# Altium schematic sheet energy_harvesting.SchDoc: Triumvi - EH
size Letter; Author: Ye-Sheng Kuo; Revision: 11; SheetNumber: 4; SheetTotal: 10
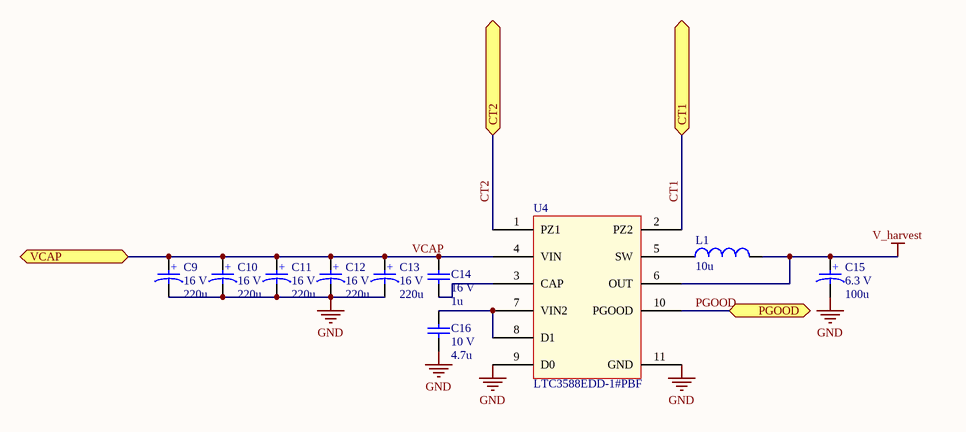
[diagram p0: energy_harvesting.SchDoc]

## Parts
C9  voltage rated: 16 V  [2917]  (hidden comment: 220u)
C10  voltage rated: 16 V  [2917]  (hidden comment: 220u)
C11  voltage rated: 16 V  [2917]  (hidden comment: 220u)
C12  voltage rated: 16 V  [2917]  (hidden comment: 220u)
C13  voltage rated: 16 V  [2917]  (hidden comment: 220u)
C14  voltage rated: 16 V  [0603]  (hidden comment: 1u)
C15  voltage rated: 6.3 V  [1206 - POLAR MARKING]  (hidden comment: 100u)
C16  voltage rated: 10 V  [0603]  (hidden comment: 4.7u)
L1  10u  [CDRH2D18]
U4  LTC3588EDD-1#PBF  [QFN-10]

## Ports
CT1, CT2, PGOOD, VCAP

## Nets
GND: C9.2 C10.2 C11.2 C12.2 C13.2 C15.2 C16.2 U4.9(D0) U4.11(GND)
V_harvest: C15.1 L1.1 U4.6(OUT)
CT1: U4.2(PZ2) ; port CT1
CT2: U4.1(PZ1) ; port CT2
PGOOD: U4.10(PGOOD) ; port PGOOD
VCAP: C9.1 C10.1 C11.1 C12.1 C13.1 C14.1 U4.4(VIN) ; port VCAP
NetC14_2: C14.2 U4.3(CAP)
NetC16_1: C16.1 U4.7(VIN2) U4.8(D1)
NetL1_2: L1.2 U4.5(SW)

## Notes on the sheet
- Title
- Date:
- Author:
- Revision:
- Sheet
- of
- University of Michigan
- File:
- (in symbol F930J107MAA) +
- (in symbol T495X227K016ATE100) +

## Library data of the parts
C9-C13 = T495X227K016ATE100: 220µF ±10% Molded Tantalum Capacitors 16V; Manufacture: Kemet; ESR: 100m Ohm; tolerance: 10%; package: 2917; Supplier 1: Digi-Key; Supplier Part Number 1: 399-10409-1-ND; Value: 220u; Manufacturer Part Number: T495X227K016ATE100
C14 = C1608X7R1C105K080AC: 1µF ±10% 16V Ceramic Capacitor X7R 0603; Manufacture: TDK; tolerance: 10%; package: 0603; Supplier 1: Digi-Key; Supplier Part Number 1: 445-1604-1-ND; Value: 1u; Temperature Coefficient: X7R; Manufacturer Part Number: C1608X7R1C105K080AC
C15 = F930J107MAA: 100µF ±20% Molded Tantalum Capacitors 6.3V 1206; Manufacture: AVX; ESR: 2 Ohm; tolerance: 20%; package: 1206; Supplier 1: Digi-Key; Supplier Part Number 1: 478-8155-1-ND; Value: 100u; Manufacturer Part Number: F930J107MAA
C16 = CGB3B1X5R1A475K055AC: 4.7µF ±10% 10V Ceramic Capacitor X5R 0603; Manufacture: TDK; tolerance: 10%; package: 0603; Supplier 1: Digi-Key; Supplier Part Number 1: 445-7482-1-ND; Value: 4.7u; Temperature Coefficient: X5R; Manufacturer Part Number: CGB3B1X5R1A475K055AC
L1 = CDRH2D18/LDNP-100NC: 10µH Shielded Inductor 1A 180 mOhm Max Nonstandard; Manufacturer: Sumida; tolerance: 30%; DCR (Max): 180m; Supplier 1: Digi-Key; Supplier Part Number 1: 308-1959-1-ND; Value: 10u; Current Rating: 1 A; Manufacturer Part Number: CDRH2D18/LDNP-100NC
U4 = LTC3588EDD-1#PBF: Piezoelectric Energy Harvesting Power Supply; Supplier 1: Digi-Key; Supplier Part Number 1: LTC3588EDD-1#PBF-ND